# Altium schematic sheet LPCB280 - ANALOG.SchDoc
size A3; Address1: Factory 10; Address2: 9-13 Dingley Avenue, Dandeong, VICTORIA 3175, AUSTRALIA; DocumentNumber: 2; Revision: 1; SheetNumber: 2; SheetTotal: 6; Lockie__PCB_SUB_ASSEMBLY: PCB Sub Component; Lockie__PCB_ASSEMBLY: PCB Assembly; Lockie__LDL: LPCB280; Lockie__PCB_DESCRIPTION: Gimbal Control Unit (GCU)
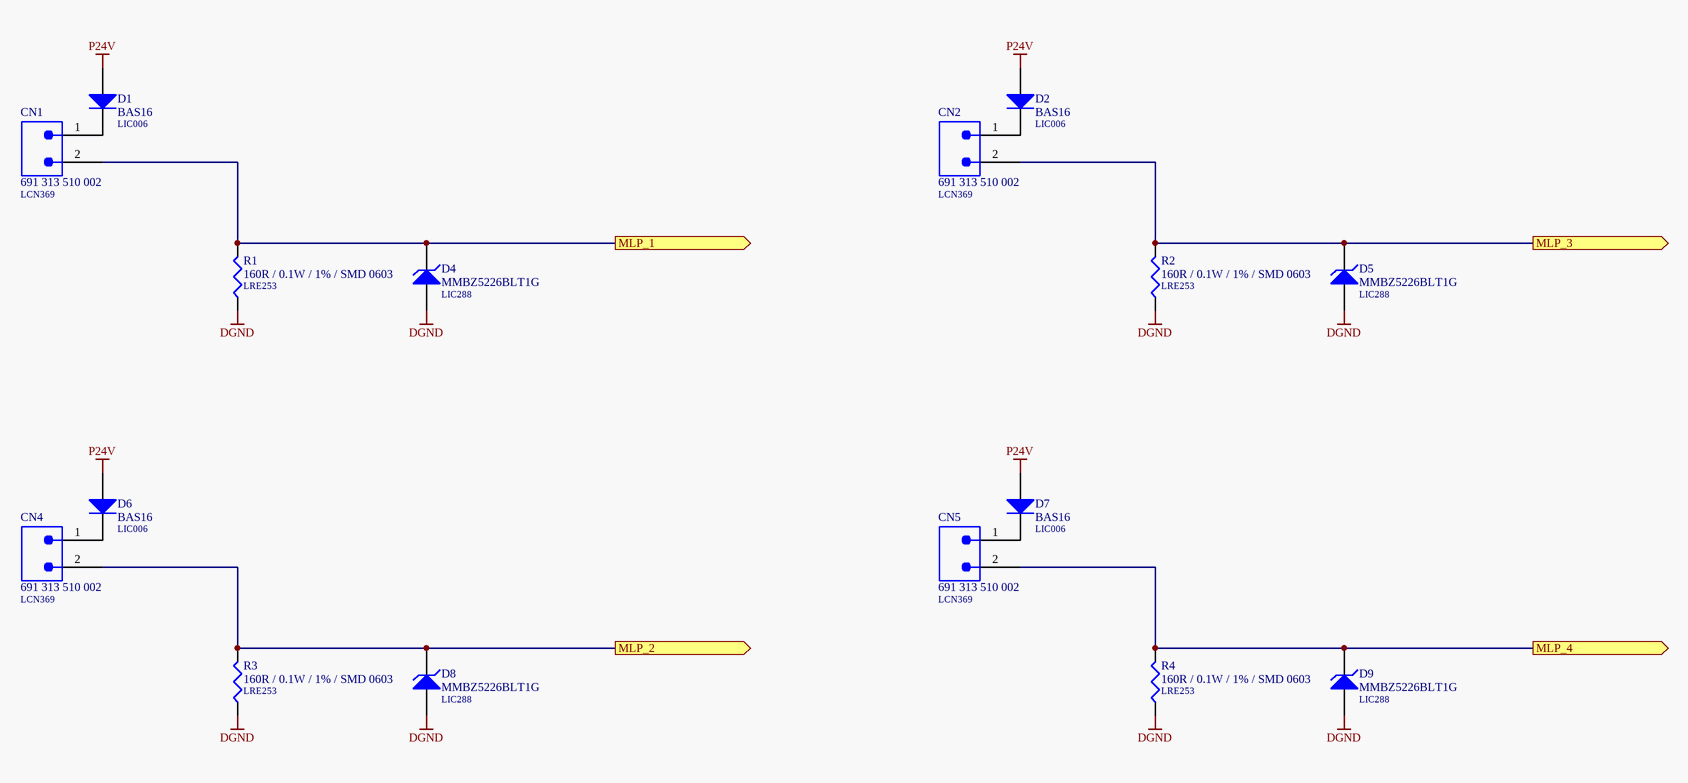
[diagram p0: LPCB280 - ANALOG.SchDoc]

## Parts
CN1  691 313 510 002  LDL_NUMBER: LCN369  [691 313 510 002]
CN2  691 313 510 002  LDL_NUMBER: LCN369  [691 313 510 002]
CN4  691 313 510 002  LDL_NUMBER: LCN369  [691 313 510 002]
CN5  691 313 510 002  LDL_NUMBER: LCN369  [691 313 510 002]
D1  BAS16  LDL_NUMBER: LIC006  [LFP021__SOT23]
D2  BAS16  LDL_NUMBER: LIC006  [LFP021__SOT23]
D4  MMBZ5226BLT1G  LDL_NUMBER: LIC288  [LFP021__SOT23]
D5  MMBZ5226BLT1G  LDL_NUMBER: LIC288  [LFP021__SOT23]
D6  BAS16  LDL_NUMBER: LIC006  [LFP021__SOT23]
D7  BAS16  LDL_NUMBER: LIC006  [LFP021__SOT23]
D8  MMBZ5226BLT1G  LDL_NUMBER: LIC288  [LFP021__SOT23]
D9  MMBZ5226BLT1G  LDL_NUMBER: LIC288  [LFP021__SOT23]
R1  160R / 0.1W / 1% / SMD 0603  LDL_NUMBER: LRE253  [LFP020__CR1608-0603-IPC7351_B]
R2  160R / 0.1W / 1% / SMD 0603  LDL_NUMBER: LRE253  [LFP020__CR1608-0603-IPC7351_B]
R3  160R / 0.1W / 1% / SMD 0603  LDL_NUMBER: LRE253  [LFP020__CR1608-0603-IPC7351_B]
R4  160R / 0.1W / 1% / SMD 0603  LDL_NUMBER: LRE253  [LFP020__CR1608-0603-IPC7351_B]

## Ports
MLP_1 (out), MLP_2 (out), MLP_3 (out), MLP_4 (out)

## Nets
DGND: D4.1(A) D5.1(A) D8.1(A) D9.1(A) R1.1 R2.1 R3.1 R4.1
P24V: D1.1(A) D2.1(A) D6.1(A) D7.1(A)
MLP_1: CN1.2 D4.3(K) R1.2 ; port MLP_1
MLP_2: CN4.2 D8.3(K) R3.2 ; port MLP_2
MLP_3: CN2.2 D5.3(K) R2.2 ; port MLP_3
MLP_4: CN5.2 D9.3(K) R4.2 ; port MLP_4
NetCN1_1: CN1.1 D1.3(K)
NetCN2_1: CN2.1 D2.3(K)
NetCN4_1: CN4.1 D6.3(K)
NetCN5_1: CN5.1 D7.3(K)

## Notes on the sheet
- PCB COMPONENT DESCRIPTION
- LDL NUMBER
- Assembly Details
- Size
- Drawing File Name
- Revision
- http://sil3.com.au
  ACN: 123 529 064
  Factory 10
  9-13 Dingley Avenue
  Dandenong, VICTORIA
  Australia
- Scale
- A3
- Sheet Details
- N.T.S
- Sheet:
- Of:

## Library data of the parts
CN1 CN2 CN4 CN5 = 691 313 510 002: Connector, Pluggable Terminal Block, 5.08mm, 2 Way, PTH; FMEDA__CHANNEL: COM; FMEDA__OPERATING__CURRENT_MAX: 0; FMEDA__OPERATING__TEMP_MAX: 50; FMEDA__OPERATING__TEMP_MIN: -20; FMEDA__OPERATING__TEMP_TYP: 27; FMEDA__OPERATING__VOLTAGE_MAX: 16; FMEDA__OPERATING__VOLTAGE_TYP: 12; FMEDA__FUNCTION_IN_SYSTEM: *; FMEDA__OPERATING__CURRENT_MIN: 0; FMEDA__OPERATING__CURRENT_TYP: 0; FMEDA__OPERATING__VOLTAGE_MIN: 0
D1 D2 D6 D7 = BAS16: Diode, Small Signal, 0.2A, 85V, SMD SOT-23 [LIC006]; FMEDA__OPERATING__CURRENT_MIN: 0; FMEDA__OPERATING__TEMP_MIN: -20; FMEDA__OPERATING__TEMP_TYP: 27; FMEDA__OPERATING__TEMP_MAX: 50; FMEDA__CHANNEL: COM; FMEDA__OPERATING__CURRENT_MAX: 0; FMEDA__OPERATING__VOLTAGE_MIN: 0; FMEDA__OPERATING__VOLTAGE_MAX: 0; FMEDA__FUNCTION_IN_SYSTEM: *; FMEDA__OPERATING__CURRENT_TYP: 0; FMEDA__OPERATING__VOLTAGE_TYP: 0
D4 D5 D8 D9 = MMBZ5226BLT1G: Diode, Zener, 3.3V, 0.225W, SMD [LIC288]; FMEDA__OPERATING__CURRENT_MAX: 0.1; FMEDA__OPERATING__CURRENT_MIN: 0; FMEDA__OPERATING__CURRENT_TYP: 0.01; FMEDA__OPERATING__TEMP_MAX: 50; FMEDA__OPERATING__TEMP_MIN: -20; FMEDA__OPERATING__TEMP_TYP: 27; FMEDA__CHANNEL: COM; FMEDA__OPERATING__VOLTAGE_MAX: 0; FMEDA__OPERATING__VOLTAGE_MIN: 0; FMEDA__OPERATING__VOLTAGE_TYP: 0; FMEDA__FUNCTION_IN_SYSTEM: *
R1-R4 = 160R / 0.1W / 1% / SMD 0603: Resistor, Ceramic Chip, 160R, 0.1W, 1%, SMD 0603 [LRE253]; FMEDA__OPERATING__POWER_MAX: 0; FMEDA__OPERATING__TEMP_MAX: 50; FMEDA__OPERATING__TEMP_MIN: -20; FMEDA__OPERATING__TEMP_TYP: 27; FMEDA__CHANNEL: COM; Value: 160R; FMEDA__OPERATING__POWER_MIN: 0; FMEDA__OPERATING__VOLTAGE_MAX: 0; FMEDA__OPERATING__VOLTAGE_MIN: 0; FMEDA__OPERATING__VOLTAGE_TYP: 0; FMEDA__FUNCTION_IN_SYSTEM: *